# Altium schematic sheet Power Management.SchDoc: Power Distribution & Management
size A4; Date: May 2021; Revision: 1.0; SheetNumber: 1; SheetTotal: 1
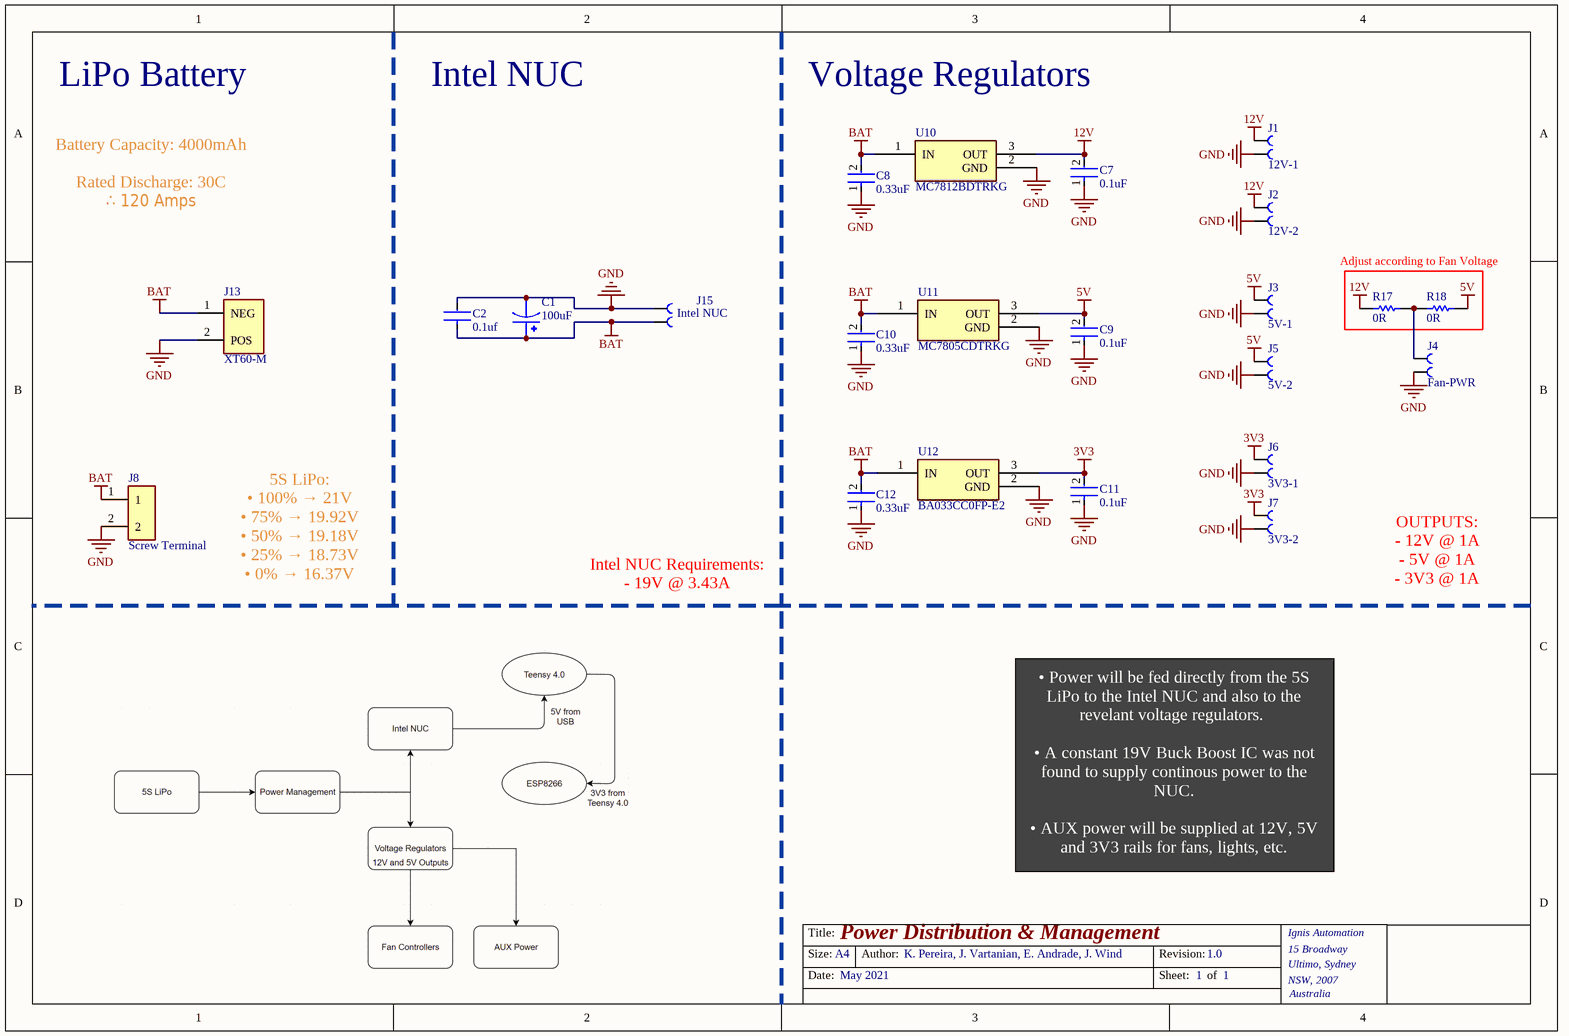
[diagram p0: Power Management.SchDoc]

## Parts
C1  100uF  [CAPAE660X800N_EEE-FPV101XAP]
C2  0.1uf  [FP-CL10-IPC_C]
C7  0.1uF  [FP-CL10-IPC_C]
C8  0.33uF  [FP-CL10-IPC_C]
C9  0.1uF  [FP-CL10-IPC_C]
C10  0.33uF  [FP-CL10-IPC_C]
C11  0.1uF  [FP-CL10-IPC_C]
C12  0.33uF  [FP-CL10-IPC_C]
J1  12V-1  [61300711821]
J2  12V-2  [61300711821]
J3  5V-1  [61300711821]
J4  Fan-PWR  [61300711821]
J5  5V-2  [61300711821]
J6  3V3-1  [61300711821]
J7  3V3-2  [61300711821]
J8  Screw Terminal  [OST_OSTTA020161]
J13  XT60-M  [AMASS_XT60-M]
J15  Intel NUC  [61300711821]
R17  0R  [RESC1608X55X30NL15T15]
R18  0R  [RESC1608X55X30NL15T15]
U10  MC7812BDTRKG  [DPAK-3_ONS]
U11  MC7805CDTRKG  [DPAK-3_ONS]
U12  BA033CC0FP-E2  [TO252-3_ROM]

## Nets
3V3: C11.2 J6.2 J7.2 U12.3(OUT)
5V: C9.2 J3.2 J5.2 R18.2 U11.3(OUT)
12V: C7.2 J1.2 J2.2 R17.1 U10.3(OUT)
BAT: C1.1 C2.1 C8.2 C10.2 C12.2 J8.1 J13.1(NEG) J15.2 U10.1(IN) U11.1(IN) U12.1(IN)
GND: C1.2 C2.2 C7.1 C8.1 C9.1 C10.1 C11.1 C12.1 J1.1 J2.1 J3.1 J4.1 J5.1 J6.1 J7.1 J8.2 J13.2(POS) J15.1 U10.2(GND) U11.2(GND) U12.2(GND)
NetJ4_2: J4.2 R17.2 R18.1

## Notes on the sheet
- LiPo Battery
- Intel NUC
- Voltage Regulators
- Battery Capacity: 4000mAh
  Rated Discharge: 30C
  ∴ 120 Amps
- Adjust according to Fan Voltage
- OUTPUTS:
  - 12V @ 1A
  - 5V @ 1A
  - 3V3 @ 1A
- 5S LiPo:
  • 100% → 21V
  • 75% → 19.92V
  • 50% → 19.18V
  • 25% → 18.73V
  • 0% → 16.37V
- Intel NUC Requirements:
  - 19V @ 3.43A
- • Power will be fed directly from the 5S LiPo to the Intel NUC and also to the revelant voltage regulators.
  • A constant 19V Buck Boost IC was not found to supply continous power to the NUC.
  • AUX power will be supplied at 12V, 5V and 3V3 rails for fans, lights, etc.
- Title:
- Size:
- Date:
- A4
- Author:
- K. Pereira, J. Vartanian, E. Andrade, J. Wind
- Revision:
- Sheet:
- of
- Ignis Automation
- 15 Broadway
- Ultimo, Sydney
- NSW, 2007
- Australia

## Library data of the parts
C1 = EEE-FPV101XAP: CAP ALUM 100UF 20% 25V SMD; Part Number: EEE-1EA101AP
C2 C7 C9 C11 = CMP-13271-003248-1: CAP CER 0.1UF 50V X7R 0603; Part Number: 1276-CL10B104KB8NNNLCT-ND
C8 C10 C12 = CMP-13271-003248-1: CAP CER 0.33UF 35V X7R 0603; Part Number: CGA3E1X7R1V334K080AC
J1-J7 J15 = 61300711821: 2 Pin
J8 = OSTTA020161: 2 Position Wire to Board Terminal Block Horizontal with Board 0.197 _5.00mm_ Through Hole
J13 = XT60-M: XT60
R17 R18 = CMP-2000-00180-1: RES 0 OHM JUMPER 1/10W 0603; Part Number: RMCF0603ZT0R00TR-ND
U10 = MC7812BDTRKG: IC REG LINEAR 12V 1A DPAK; Part Number: MC7812BDTRKGOSCT-ND
U11 = MC7805CDTRKG: IC REG LINEAR 5V 1A DPAK; Part Number: MC7805CDTRKGOSCT-ND
U12 = BA033CC0FP-E2: IC REG LINEAR 3.3V 1A TO252-3; Part Number: BA033CC0FP-E2CT-ND